# Altium project sdc_prech_proj.PrjPCB (part 2 of 2)

## Sheet BSPD.SchDoc
size A4
Used 2 times, as channels B1, B2. Parts and nets are listed once, with the designators drawn on the sheet.
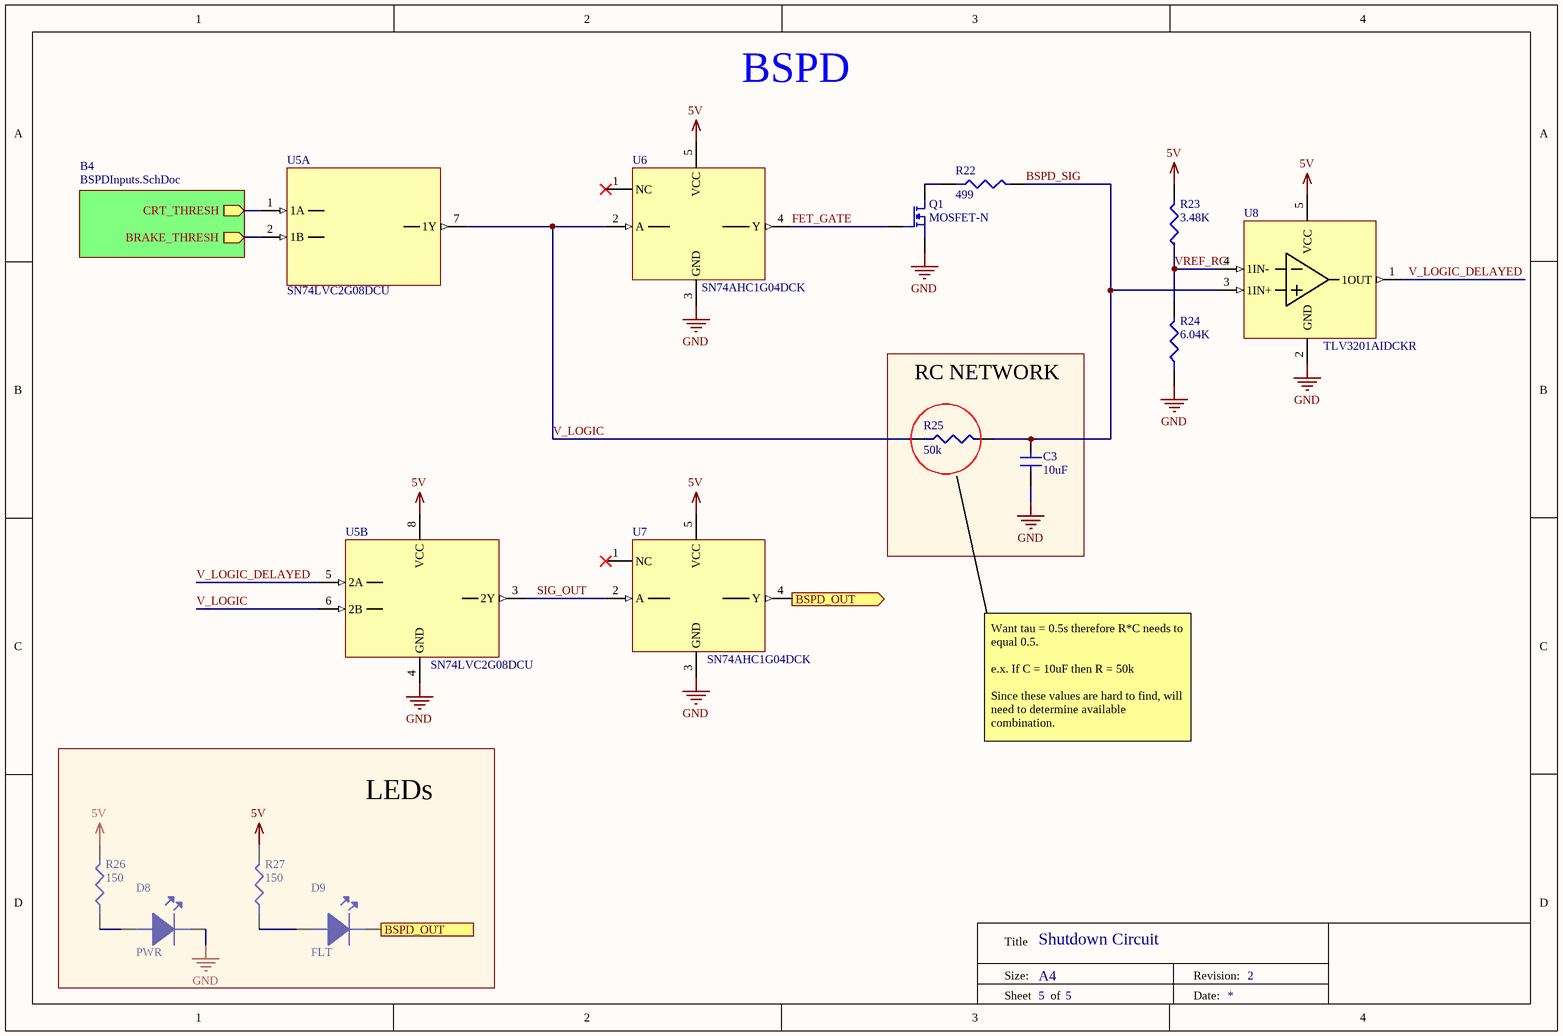
[diagram p3: BSPD.SchDoc]

### Parts
C3  10uF  [C0805]
D8  PWR  [LED_0603]
D9  FLT  [LED_0603]
Q1  MOSFET-N  [MOSFET]
R22  499  [R0805]
R23  3.48K  [R0805]
R24  6.04K  [R0805]
R25  50k  [RESC2013X12N]
R26  150  [RESC2012X07N]
R27  150  [RESC2012X07N]
U5  SN74LVC2G08DCU  [SN74LVC2G08DCUR]  (parts A,B of 2)
U6  SN74AHC1G04DCK  [SN74AHC1G04DCK]
U7  SN74AHC1G04DCK  [SN74AHC1G04DCK]
U8  TLV3201AIDCKR  [TLV3201AIDCK]

### Blocks framed on the sheet
RC NETWORK: C3 R25
LEDs: D8 D9 R26 R27

### Sub-sheets
B4 = BSPDInputs.SchDoc: BRAKE_THRESH (out), CRT_THRESH (out)

### Ports
BSPD_OUT (out)

### Nets
5V: R23.2 R26.2 R27.2 U5.8(VCC) U6.5(VCC) U7.5(VCC) U8.5(VCC)
GND: C3.1 D8.2 Q1.2 R24.1 U5.4(GND) U6.3(GND) U7.3(GND) U8.2(GND)
BSPD_OUT: D9.2 U7.4(Y) ; port BSPD_OUT
BSPD_SIG: C3.2 R22.2 R25.2 U8.3(1IN+)
FET_GATE: Q1.1 U6.4(Y)
SIG_OUT: U5.3(2Y) U7.2(A)
V_LOGIC: R25.1 U5.6(2B) U5.7(1Y) U6.2(A)
V_LOGIC_DELAYED: U5.5(2A) U8.1(1OUT)
VREF_RC: R23.1 R24.2 U8.4(1IN-)
NetD8_1: D8.1 R26.1
NetD9_1: D9.1 R27.1
NetQ1_3: Q1.3 R22.1
NetU5_1: U5.1(1A) ; sheet B4/CRT_THRESH
NetU5_2: U5.2(1B) ; sheet B4/BRAKE_THRESH

Not connected (* = marked no-connect by the designer): U6 1(NC)*; U7 1(NC)*

### Channels
B1: designators end in _B1; ports BSPD_OUT=NetD9_B1_2
B2: designators end in _B2; ports BSPD_OUT=BSPD_TO_VCU

### Notes on the sheet
- BSPD
- Want tau = 0.5s therefore R*C needs to equal 0.5.
  e.x. If C = 10uF then R = 50k
  Since these values are hard to find, will need to determine available combination.
- Shutdown Circuit
- 2
- 5
- Title
- Size:
- A4
- Revision:
- Sheet
- of
- Date:

### Library data of the parts
C3 = CL21A106KPFNNNG: Cap Ceramic 10uF 10V X5R 10% SMD 0805 85C Embossed T/R; Manufacturer: Samsung; Supplier 1: Digi-Key; Manufacturer Part Number: CL21A106KPFNNNG; Stock 1: 0; Pricing 1: 1=0.15, 10=0.104, 100=0.0489, 500=0.03428, 1000=0.02837 (USD); Mount: Surface Mount; Case/Package: 0805; Case Code (Metric): 2012; Case Code (Imperial): 0805; Min Operating Temperature: -55°C; Max Operating Temperature: 85°C; Capacitance: 10uF; Tolerance: 10%; Dielectric: X5R; Voltage: 10V; Voltage Rating: 10V; Packaging: Tape and Reel; Package Quantity: 3000; Termination: Wraparound; Length: 2mm; Height: 1.25mm; Depth: 1.25mm; Width: 0.049inch; Thickness: 0.053inch; Radiation Hardening: No; Lead Free: Lead Free; ComponentLink1URL: http://www1.futureelectronics.com/doc/SAMSUNG/CL21A106KPFNNNG.pdf?src-supplier=Future+Electronics; ComponentLink1Description: http://www1.futureelectronics.com/doc/SAMSUNG/CL21A106KPFNNNG.pdf?src-supplier=Future+Electronics; ComponentLink2URL: https://www.verical.com/server-webapp/html/getDatasheet?partID=640497&src-supplier=Verical; ComponentLink2Description: https://www.verical.com/server-webapp/html/getDatasheet?partID=640497&src-supplier=Verical; Supplier Part Number 1: 1276-6456-1-ND
D8 = LTST-C191KGKT: LED GREEN CLEAR SMD; Manufacturer: Vishay Lite-On; Lens Color: Colorless; Power Rating: 75mW; Luminous Intensity: 35mcd; Viewing Angle: 130°; Lens Style: Diffused,Colorless,Rectangular,Clear; Forward Current: 30mA; Forward Voltage: 2V; Dominant Wavelength: 571nm; Test Current: 20mA; Number of Elements: 1; Wavelength: 574nm; Reverse Voltage: 5V; Supplier 1: Digi-Key; Manufacturer Part Number: LTST-C191KGKT; Stock 1: 1356717; Pricing 1: 1=0.29, 10=0.211, 25=0.1556, 100=0.1111, 250=0.07556, 500=0.06666, 1000=0.05222, 2500=0.05111 (USD); Mount: Surface Mount; Case/Package: 0603; Number of Pins: 2; Color: Green; Case Code (Metric): 1608; Case Code (Imperial): 0603; Min Operating Temperature: -55°C; Max Operating Temperature: 85°C; Packaging: Tape and Reel; Package Quantity: 1; Illumination Color: Green; Lens Transparency: Clear; Power Dissipation: 75mW; Number of LEDs: 1; Length: 1.6mm; Height: 0.55mm; Width: 0.8mm; Depth: 0.8mm; Radiation Hardening: No; Lead Free: Lead Free; ComponentLink1URL: http://www.mouser.com/ds/2/239/LTST-C191KGKT-1141954.pdf?src-supplier=Mouser; ComponentLink1Description: http://www.mouser.com/ds/2/239/LTST-C191KGKT-1141954.pdf?src-supplier=Mouser; ComponentLink2URL: http://optoelectronics.liteon.com/upload/download/DS22-2000-228/LTST-C191KGKT.PDF?src-supplier=Digi-Key; ComponentLink2Description: http://optoelectronics.liteon.com/upload/download/DS22-2000-228/LTST-C191KGKT.PDF?src-supplier=Digi-Key; ComponentLink3URL: https://www.verical.com/server-webapp/html/getDatasheet?partID=103913&src-supplier=Verical; ComponentLink3Description: https://www.verical.com/server-webapp/html/getDatasheet?partID=103913&src-supplier=Verical; ComponentLink4URL: http://uk.rs-online.com/webdocs/0dc0/0900766b80dc02b1.pdf?src-supplier=RSComponents; ComponentLink4Description: http://uk.rs-online.com/webdocs/0dc0/0900766b80dc02b1.pdf?src-supplier=RSComponents; ComponentLink5URL: http://www1.futureelectronics.com/doc/LITE-ON/LTST-C191KGKT.pdf?src-supplier=Future+Electronics; ComponentLink5Description: http://www1.futureelectronics.com/doc/LITE-ON/LTST-C191KGKT.pdf?src-supplier=Future+Electronics; Supplier Part Number 1: 160-1446-1-ND
D9 = LTST-C191KRKT: LED RED CLEAR SMD; Manufacturer: Vishay Lite-On; Lens Color: Colorless; Power Rating: 75mW; Luminous Intensity: 54mcd; Viewing Angle: 130°; Forward Voltage: 2V; Lens Style: Clear,Diffused,Colorless,Rectangular; Forward Current: 30mA; Dominant Wavelength: 631nm; Test Current: 20mA; Number of Elements: 1; Wavelength: 639nm; Reverse Voltage: 5V; Supplier 1: Digi-Key; Manufacturer Part Number: LTST-C191KRKT; Stock 1: 1012880; Pricing 1: 1=0.29, 10=0.211, 25=0.1556, 100=0.1111, 250=0.07556, 500=0.06666, 1000=0.05222, 2500=0.05111 (USD); Mount: Surface Mount; Case/Package: 0603; Number of Pins: 2; Color: Red; Case Code (Metric): 1608; Case Code (Imperial): 0603; Min Operating Temperature: -55°C; Max Operating Temperature: 85°C; Packaging: Tape and Reel; Package Quantity: 1; Illumination Color: Red; Lens Transparency: Clear; Power Dissipation: 75mW; Number of LEDs: 1; Voltage: 2V; Length: 1.6mm; Height: 0.55mm; Width: 0.8mm; Depth: 0.8mm; Radiation Hardening: No; Lead Free: Lead Free; ComponentLink1URL: http://optoelectronics.liteon.com/upload/download/DS22-2000-223/LTST-C191KRKT.PDF?src-supplier=Digi-Key; ComponentLink1Description: http://optoelectronics.liteon.com/upload/download/DS22-2000-223/LTST-C191KRKT.PDF?src-supplier=Digi-Key; ComponentLink2URL: http://www1.futureelectronics.com/doc/LITE-ON/LTST-C191KRKT.pdf?src-supplier=Future+Electronics; ComponentLink2Description: http://www1.futureelectronics.com/doc/LITE-ON/LTST-C191KRKT.pdf?src-supplier=Future+Electronics; ComponentLink3URL: https://www.verical.com/server-webapp/html/getDatasheet?partID=141922&src-supplier=Verical; ComponentLink3Description: https://www.verical.com/server-webapp/html/getDatasheet?partID=141922&src-supplier=Verical; ComponentLink4URL: http://www.mouser.com/ds/2/239/LTST-C191KRKT-1140668.pdf?src-supplier=Mouser; ComponentLink4Description: http://www.mouser.com/ds/2/239/LTST-C191KRKT-1140668.pdf?src-supplier=Mouser; Supplier Part Number 1: 160-1447-1-ND
Q1 = BSS138LT3G: MOSFET N-CH 50V 200MA SOT-23; Manufacturer: ON Semiconductor; Nominal Vgs: 500mV; Input Capacitance: 50pF; Number of Elements: 1; Max Power Dissipation: 225mW; Rds On Max: 3.5R; Turn-Off Delay Time: 20ns; Element Configuration: Single; Gate to Source Voltage (Vgs): 20V; Supplier 1: Digi-Key; Manufacturer Part Number: BSS138LT3G; Stock 1: 195647; Pricing 1: 1=0.45, 10=0.408, 100=0.2284, 500=0.12234, 1000=0.0832 (USD); Case/Package: SOT-23-3; Number of Pins: 3; Min Operating Temperature: -55°C; Max Operating Temperature: 150°C; Package Quantity: 1; Packaging: Tape and Reel; Drain to Source Voltage (Vdss): 50V; Continuous Drain Current (ID): 200mA; Drain to Source Breakdown Voltage: 50V; Power Dissipation: 225mW; Drain to Source Resistance: 3.5R; Threshold Voltage: 500mV; Turn-On Delay Time: 20ns; Voltage Rating (DC): 50V; Current Rating: 200mA; On-State Resistance: 3.5R; Length: 2.9mm; Height: 0.94mm; Width: 1.3mm; Radiation Hardening: No; REACH SVHC: No SVHC; Lead Free: Lead Free; Halogen Free: Halogen Free; Supplier Part Number 1: BSS138LT3GOSCT-ND; ComponentLink1Description: DigiKey; ComponentLink1URL: https://www.digikey.ca/product-detail/en/BSS138LT3G/BSS138LT3GOSCT-ND/2120566/?itemSeq=274498102
R22 = ERA-6AEB4990V: RES SMD 499 OHM 0.1% 1/8W 0805; Manufacturer: Panasonic; Resistance: 499R; Power Rating: 125mW; Voltage Rating: 200V; Temperature Coefficient: 25ppm/°C; Voltage Rating (DC): 100V; Supplier 1: Digi-Key; Manufacturer Part Number: ERA-6AEB4990V; Stock 1: 110604; Pricing 1: 1=0.36, 10=0.302, 100=0.1182, 1000=0.04948, 2500=0.04536 (USD); Mount: Surface Mount; Case/Package: 0805; Number of Pins: 2; Case Code (Imperial): 0805; Case Code (Metric): 2012; Contact Plating: Tin; Min Operating Temperature: -55°C; Max Operating Temperature: 155°C; Tolerance: 0.1%; Packaging: Tape and Reel; Package Quantity: 5000; Termination: SMD/SMT; Composition: Metal Film,Thin Film; Number of Terminations: 2; Military Standard: Not; Max Power Dissipation: 125mW; Working Voltage: 100V; Length: 2mm; Height: 0.5mm; Width: 1.25mm; Depth: 1.25mm; Radiation Hardening: No; Lead Free: Lead Free; REACH SVHC: No SVHC; ComponentLink1URL: http://uk.rs-online.com/webdocs/0eb1/0900766b80eb1d8c.pdf?src-supplier=RSComponents; ComponentLink1Description: http://uk.rs-online.com/webdocs/0eb1/0900766b80eb1d8c.pdf?src-supplier=RSComponents; ComponentLink2URL: http://www.farnell.com/datasheets/485442.pdf?src-supplier=Farnell; ComponentLink2Description: http://www.farnell.com/datasheets/485442.pdf?src-supplier=Farnell; ComponentLink3URL: http://www.farnell.com/datasheets/2052875.pdf?src-supplier=Farnell; ComponentLink3Description: http://www.farnell.com/datasheets/2052875.pdf?src-supplier=Farnell; ComponentLink4URL: http://industrial.panasonic.com/www-data/pdf/AOA0000/AOA0000CE26.pdf?src-supplier=Avnet+Europe; ComponentLink4Description: http://industrial.panasonic.com/www-data/pdf/AOA0000/AOA0000CE26.pdf?src-supplier=Avnet+Europe; ComponentLink5URL: http://www.farnell.com/datasheets/485442.pdf?src-supplier=Element14; ComponentLink5Description: http://www.farnell.com/datasheets/485442.pdf?src-supplier=Element14; ComponentLink6URL: http://industrial.panasonic.com/www-data/pdf/AOA0000/AOA0000CE26.pdf?src-supplier=Avnet; ComponentLink6Description: http://industrial.panasonic.com/www-data/pdf/AOA0000/AOA0000CE26.pdf?src-supplier=Avnet; ComponentLink7URL: https://produktinfo.conrad.com/datenblaetter/450000-474999/459335-da-01-en-WIDERSTAND_0805_ERA.pdf?src-supplier=Conrad; ComponentLink7Description: https://produktinfo.conrad.com/datenblaetter/450000-474999/459335-da-01-en-WIDERSTAND_0805_ERA.pdf?src-supplier=Conrad; Supplier Part Number 1: P499DACT-ND
R23 = ERA-6AEB3481V: RES SMD 3.48K OHM 0.1% 1/8W 0805; Manufacturer: Panasonic; Resistance: 3.48kR; Temperature Coefficient: 25ppm/°C; Power Rating: 125mW; Voltage Rating: 100V; Supplier 1: Digi-Key; Manufacturer Part Number: ERA-6AEB3481V; Stock 1: 4330; Pricing 1: 1=0.36000, 10=0.30200, 100=0.11820, 1000=0.04948, 2500=0.04536 (USD); RoHS: Yes; Mount: Surface Mount; Case/Package: 0805; Number of Pins: 2; Contact Plating: Tin; Case Code (Imperial): 0805; Case Code (Metric): 2012; Min Operating Temperature: -55°C; Max Operating Temperature: 155°C; Tolerance: 0.1%; Composition: Metal Film,Thin Film; Packaging: Tape and Reel; Package Quantity: 1; Number of Terminations: 2; Termination: Solder; Max Power Dissipation: 125mW; Voltage Rating (DC): 100V; Features: Automotive AEC-Q200; Length: 2mm; Height: 0.5mm; Width: 1.25mm; Depth: 1.25mm; Radiation Hardening: No; Lead Free: Lead Free; ComponentLink1URL: https://datasheet.ciiva.com/11810/0900766b80eb1d8c-11810465.pdf?src-supplier=RSComponents; ComponentLink1Description: https://datasheet.ciiva.com/11810/0900766b80eb1d8c-11810465.pdf?src-supplier=RSComponents; ComponentLink2URL: https://datasheet.ciiva.com/41450/001181278-da-01-en-widerstand-era-0805-3k48-0-1-5000st-41450436.pdf?src-supplier=Conrad; ComponentLink2Description: https://datasheet.ciiva.com/41450/001181278-da-01-en-widerstand-era-0805-3k48-0-1-5000st-41450436.pdf?src-supplier=Conrad; ComponentLink3URL: https://datasheet.ciiva.com/9196/aoa0000ce26-9196342.pdf?src-supplier=Avnet; ComponentLink3Description: https://datasheet.ciiva.com/9196/aoa0000ce26-9196342.pdf?src-supplier=Avnet; ComponentLink4URL: https://datasheet.ciiva.com/24026/aoa0000ce26-32660-24026342.pdf?src-supplier=Mouser; ComponentLink4Description: https://datasheet.ciiva.com/24026/aoa0000ce26-32660-24026342.pdf?src-supplier=Mouser; ComponentLink5URL: https://datasheet.ciiva.com/5974/485442-5974247.pdf?src-supplier=Farnell; ComponentLink5Description: https://datasheet.ciiva.com/5974/485442-5974247.pdf?src-supplier=Farnell; ComponentLink6URL: https://datasheet.ciiva.com/5974/485442-5974251.pdf?src-supplier=Farnell; ComponentLink6Description: https://datasheet.ciiva.com/5974/485442-5974251.pdf?src-supplier=Farnell; ComponentLink7URL: https://datasheet.ciiva.com/5974/485442-5974239.pdf?src-supplier=Farnell; ComponentLink7Description: https://datasheet.ciiva.com/5974/485442-5974239.pdf?src-supplier=Farnell; Supplier Part Number 1: P3.48KDACT-ND
R24 = ERA6AEB6041V: RES SMD 6.04K OHM 0.1% 1/8W 0805; Manufacturer: Panasonic; Resistance: 6.04kR; Temperature Coefficient: 25ppm/°C; Power Rating: 125mW; Voltage Rating: 100V; Supplier 1: Digi-Key; Manufacturer Part Number: ERA6AEB6041V; Stock 1: 15898; Pricing 1: 1=0.36, 10=0.302, 100=0.1182, 1000=0.04948, 2500=0.04536 (USD); Mount: Surface Mount; Case/Package: 0805; Number of Pins: 2; Weight: 0.000194oz; Case Code (Imperial): 0805; Case Code (Metric): 2012; Contact Plating: Tin; Min Operating Temperature: -55°C; Max Operating Temperature: 155°C; Packaging: Tape and Reel; Tolerance: 0.1%; Composition: Metal Film,Thin Film; Termination: SMD/SMT; Number of Terminations: 2; Max Power Dissipation: 125mW; Features: Automotive AEC-Q200; Package Quantity: 1; Voltage Rating (DC): 100V; Length: 2mm; Height: 0.5mm; Width: 1.25mm; Depth: 1.25mm; Radiation Hardening: No; Lead Free: Lead Free; ComponentLink1URL: http://www.mouser.com/ds/2/315/AOA0000C237-1100991.pdf?src-supplier=Mouser; ComponentLink1Description: http://www.mouser.com/ds/2/315/AOA0000C237-1100991.pdf?src-supplier=Mouser; ComponentLink2URL: http://www.farnell.com/datasheets/485442.pdf?src-supplier=Element14; ComponentLink2Description: http://www.farnell.com/datasheets/485442.pdf?src-supplier=Element14; ComponentLink3URL: http://industrial.panasonic.com/www-data/pdf/AOA0000/AOA0000CE26.pdf?src-supplier=Avnet; ComponentLink3Description: http://industrial.panasonic.com/www-data/pdf/AOA0000/AOA0000CE26.pdf?src-supplier=Avnet; ComponentLink4URL: http://www.farnell.com/datasheets/485442.pdf?src-supplier=Farnell; ComponentLink4Description: http://www.farnell.com/datasheets/485442.pdf?src-supplier=Farnell; ComponentLink5URL: http://uk.rs-online.com/webdocs/0eb1/0900766b80eb1d8c.pdf?src-supplier=RSComponents; ComponentLink5Description: http://uk.rs-online.com/webdocs/0eb1/0900766b80eb1d8c.pdf?src-supplier=RSComponents; ComponentLink6URL: http://www.produktinfo.conrad.com/datenblaetter/1100000-1199999/001181293-da-01-en-WIDERSTAND_ERA_0805_6K04_0_1__5000ST.pdf?src-supplier=Conrad; ComponentLink6Description: http://www.produktinfo.conrad.com/datenblaetter/1100000-1199999/001181293-da-01-en-WIDERSTAND_ERA_0805_6K04_0_1__5000ST.pdf?src-supplier=Conrad; Supplier Part Number 1: P6.04KDACT-ND
R25 = PTN0805E5002BST1: RES 50K OHM 0.1% 1/5W 0805; Manufacturer: Vishay; Supplier 1: Digi-Key; Manufacturer Part Number: PTN0805E5002BST1; Stock 1: 3755; Pricing 1: 1=0.78, 10=0.647, 100=0.4343 (USD); Supplier Part Number 1: 764-1535-6-ND; ComponentLink1Description: DigiKey; ComponentLink1URL: https://www.digikey.ca/product-detail/en/PTN0805E5002BST1/764-1535-1-ND/7103319/?itemSeq=274495083
R26 R27 = ERJ6ENF1500V: RES SMD 150 OHM 1% 1/8W 0805; Manufacturer: Panasonic; Voltage Rating: 150V; Resistance: 150R; Power Rating: 125mW; Temperature Coefficient: 100ppm/°C; Supplier 1: Digi-Key; Manufacturer Part Number: ERJ6ENF1500V; Stock 1: 125951; Pricing 1: 1=0.1, 10=0.081, 100=0.0311, 1000=0.01367, 2500=0.01181 (USD); Mount: Surface Mount; Case/Package: 0805; Number of Pins: 2; Case Code (Metric): 2012; Case Code (Imperial): 0805; Contact Plating: Tin; Min Operating Temperature: -55°C; Max Operating Temperature: 155°C; Packaging: Tape and Reel; Tolerance: 1%; Package Quantity: 1; Composition: Thick Film; Number of Terminations: 2; Military Standard: Not; Termination: SMD/SMT; Max Power Dissipation: 125mW; Voltage Rating (DC): 150V; Features: Automotive AEC-Q200; Working Voltage: 150V; Length: 2mm; Height: 0.6mm; Width: 0.049inch; Depth: 1.25mm; Radiation Hardening: No; REACH SVHC: No SVHC; Lead Free: Lead Free; ComponentLink1URL: http://www.farnell.com/datasheets/426256.pdf?src-supplier=Element14; ComponentLink1Description: http://www.farnell.com/datasheets/426256.pdf?src-supplier=Element14; ComponentLink2URL: https://www.alliedelec.com/m/d/623f45ff1957d936ff56d46fd1c28cac.pdf?src-supplier=Allied+Electronics; ComponentLink2Description: https://www.alliedelec.com/m/d/623f45ff1957d936ff56d46fd1c28cac.pdf?src-supplier=Allied+Electronics; ComponentLink3URL: http://www.farnell.com/datasheets/1678782.pdf?src-supplier=Element14; ComponentLink3Description: http://www.farnell.com/datasheets/1678782.pdf?src-supplier=Element14; ComponentLink4URL: http://industrial.panasonic.com/www-data/pdf/AOA0000/AOA0000CE2.pdf?src-supplier=Avnet; ComponentLink4Description: http://industrial.panasonic.com/www-data/pdf/AOA0000/AOA0000CE2.pdf?src-supplier=Avnet; ComponentLink5URL: http://www.mouser.com/ds/2/315/AOA0000C283-1093288.pdf?src-supplier=Mouser; ComponentLink5Description: http://www.mouser.com/ds/2/315/AOA0000C283-1093288.pdf?src-supplier=Mouser; ComponentLink6URL: http://www.farnell.com/datasheets/426256.pdf?src-supplier=Farnell; ComponentLink6Description: http://www.farnell.com/datasheets/426256.pdf?src-supplier=Farnell; Supplier Part Number 1: P150CCT-ND
U5 = SN74LVC2G08DCUR: Dual 2-Input Positive-AND Gate; Supplier 1: Digi-Key; Supplier Part Number 1: 296-26615-1-ND
U6 U7 = SN74AHC1G04DCK: The SN74AHC1G04 contains one inverter gate. The / device performs the Boolean function Y = A bar.; Manufacturer: Texas Instruments; Manufacturer Part Number: SN74AHC1G04DCKR; Output Current: 8mA; Number of Inputs: 1; Min Supply Voltage: 2V; Max Supply Voltage: 5.5V; Logic Function: Buffer,Inverter,Inverting; Propagation Delay: 12ns; Quiescent Current: 1uA; High Level Output Current: -8mA; Turn-On Delay Time: 10.6ns; Schmitt Trigger Input: No; Supplier 1: Digi-Key; ComponentLink1Description: Digi-Key; ComponentLink1URL: https://www.digikey.com/product-detail/en/texas-instruments/SN74AHC1G04DCKR/296-1090-1-ND/276358; Supplier Part Number 1: 296-1090-1-ND; Stock 1: 120362; Pricing 1: 1=0.43, 10=0.32, 100=0.1996, 500=0.13658, 1000=0.10506 (USD); Mount: Surface Mount; Case/Package: SC; Number of Pins: 5; Weight: 8.8E-05oz; Contact Plating: Gold; Min Operating Temperature: -40°C; Max Operating Temperature: 125°C; Max Output Current: 8mA; Number of Elements: 1; Packaging: Tape and Reel; Package Quantity: 1; Number of Circuits: 1; Low Level Output Current: 8mA; Termination: SMD/SMT; Number of Gates: 1; Number of Bits: 1; Length: 2mm; Height: 0.9mm; Width: 1.25mm; Radiation Hardening: No; REACH SVHC: No SVHC; Lead Free: Lead Free; ComponentLink2URL: http://www.farnell.com/datasheets/1759812.pdf?src-supplier=Element14; ComponentLink2Description: http://www.farnell.com/datasheets/1759812.pdf?src-supplier=Element14; ComponentLink3URL: http://www.jameco.com/Jameco/Products/ProdDS/912915.pdf?src-supplier=Jameco; ComponentLink3Description: http://www.jameco.com/Jameco/Products/ProdDS/912915.pdf?src-supplier=Jameco; ComponentLink4URL: http://www.ti.com/lit/ds/symlink/sn74ahc1g04.pdf?src-supplier=Digi-Key; ComponentLink4Description: http://www.ti.com/lit/ds/symlink/sn74ahc1g04.pdf?src-supplier=Digi-Key; ComponentLink5URL: https://www.verical.com/server-webapp/html/getDatasheet?partID=53378&src-supplier=Verical; ComponentLink5Description: https://www.verical.com/server-webapp/html/getDatasheet?partID=53378&src-supplier=Verical; ComponentLink6URL: http://www.farnell.com/datasheets/2024272.pdf?src-supplier=Element14; ComponentLink6Description: http://www.farnell.com/datasheets/2024272.pdf?src-supplier=Element14; ComponentLink7URL: http://www.ti.com/general/docs/lit/getliterature.tsp?genericPartNumber=SN74AHC1G04&amp;&amp;fileType=pdf&src-supplier=Avnet+Asia; ComponentLink7Description: http://www.ti.com/general/docs/lit/getliterature.tsp?genericPartNumber=SN74AHC1G04&amp;&amp;fileType=pdf&src-supplier=Avnet+Asia
U8 = TLV3201AIDCKR: Comparator Single R-R I/P 5.5V 5-Pin SC-70 T/R; Manufacturer: Texas Instruments; Common Mode Rejection Ratio: 85dB; Min Supply Voltage: 2.7V; Number of Elements: 1; Propagation Delay: 50ns; Nominal Supply Current: 50uA; Input Offset Voltage (Vos): 5mV; Input Bias Current: 5nA; Quiescent Current: 40uA; Hysteresis: 1.2mV; Response Time: 0.047us; Supplier 1: Digi-Key; Manufacturer Part Number: TLV3201AIDCKR; Stock 1: 34988; Pricing 1: 1=1.36000, 10=1.21500, 100=0.94760, 500=0.78280, 1000=0.61800 (USD); RoHS: Yes; Mount: Surface Mount; Case/Package: SOT-23-5; Number of Pins: 5; Min Operating Temperature: -40°C; Max Operating Temperature: 125°C; Max Supply Voltage: 5.5V; Packaging: Tape and Reel; Package Quantity: 3000; Max Input Current: 5nA; Max Supply Current: 40uA; Number of Channels: 1; Power Supply Rejection Ratio (PSRR): 85dB; Type: General Purpose; Radiation Hardening: No; Lead Free: Lead Free; ComponentLink1URL: https://datasheet.ciiva.com/29635/tlv3201-29635045.pdf?src-supplier=Digi-Key; ComponentLink1Description: https://datasheet.ciiva.com/29635/tlv3201-29635045.pdf?src-supplier=Digi-Key; ComponentLink2URL: https://datasheet.ciiva.com/2966/tlv3202-2966812.pdf?src-supplier=Avnet; ComponentLink2Description: https://datasheet.ciiva.com/2966/tlv3202-2966812.pdf?src-supplier=Avnet; Supplier Part Number 1: 296-36751-1-ND

## Sheet BSPDInputs.SchDoc
size A4
Used 3 times, as channels B1/B4, B3, B2/B4. Parts and nets are listed once, with the designators drawn on the sheet.
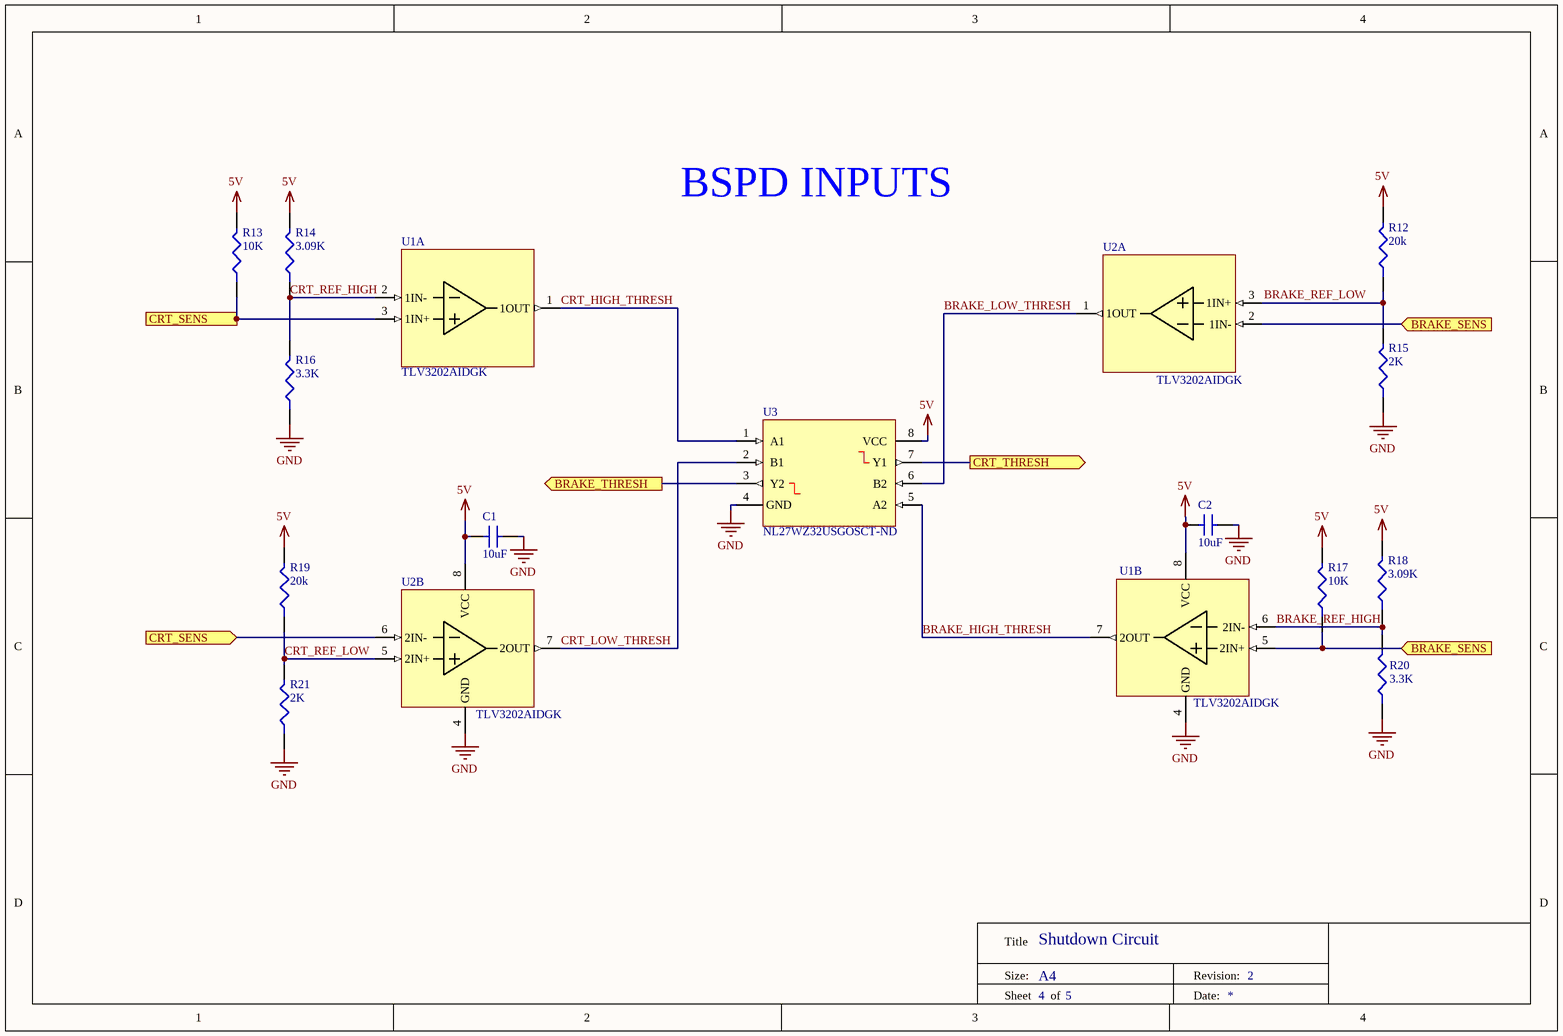
[diagram p4: BSPDInputs.SchDoc]

### Parts
C1  10uF  [C0805]
C2  10uF  [C0805]
R12  20k  [RESC1608X06N]
R13  10K  [R0805]
R14  3.09K  [ERJPB3]
R15  2K  [R0805]
R16  3.3K  [ERJPB3]
R17  10K  [R0805]
R18  3.09K  [ERJPB3]
R19  20k  [RESC1608X06N]
R20  3.3K  [ERJPB3]
R21  2K  [R0805]
U1  TLV3202AIDGK  [TLV3202AIDGK]  (parts A,B of 2)
U2  TLV3202AIDGK  [TLV3202AIDGK]  (parts A,B of 2)
U3  NL27WZ32USGOSCT-ND  [TSSOP50P310X90-8N]

### Ports
BRAKE_SENS (in), BRAKE_THRESH (out), CRT_SENS (in), CRT_THRESH (out)

### Nets
5V: C1.2 C2.2 R12.2 R13.2 R14.2 R17.2 R18.2 R19.2 U1.8(VCC) U2.8(VCC) U3.8(VCC)
GND: C1.1 C2.1 R15.1 R16.1 R20.1 R21.1 U1.4(GND) U2.4(GND) U3.4(GND)
BRAKE_HIGH_THRESH: U1.7(2OUT) U3.5(A2)
BRAKE_LOW_THRESH: U2.1(1OUT) U3.6(B2)
BRAKE_REF_HIGH: R18.1 R20.2 U1.6(2IN-)
BRAKE_REF_LOW: R12.1 R15.2 U2.3(1IN+)
BRAKE_SENS: R17.1 U1.5(2IN+) U2.2(1IN-) ; port BRAKE_SENS
BRAKE_THRESH: U3.3(Y2) ; port BRAKE_THRESH
CRT_HIGH_THRESH: U1.1(1OUT) U3.1(A1)
CRT_LOW_THRESH: U2.7(2OUT) U3.2(B1)
CRT_REF_HIGH: R14.1 R16.2 U1.2(1IN-)
CRT_REF_LOW: R19.1 R21.2 U2.5(2IN+)
CRT_SENS: R13.1 U1.3(1IN+) U2.6(2IN-) ; port CRT_SENS
CRT_THRESH: U3.7(Y1) ; port CRT_THRESH

### Channels
B1/B4: designators end in _B1_B4; ports BRAKE_SENS=NetR17_B1_B4_1 BRAKE_THRESH=NetU3_B1_B4_3 CRT_SENS=NetR13_B1_B4_1 CRT_THRESH=NetU3_B1_B4_7
B3: designators end in _B3; ports BRAKE_SENS=NetM3_3 BRAKE_THRESH=NetU3_B3_3 CRT_SENS=NetM3_2 CRT_THRESH=NetU3_B3_7
B2/B4: designators end in _B2_B4; ports BRAKE_SENS=NetR17_B2_B4_1 BRAKE_THRESH=NetU3_B2_B4_3 CRT_SENS=NetR13_B2_B4_1 CRT_THRESH=NetU3_B2_B4_7

### Notes on the sheet
- BSPD INPUTS
- Shutdown Circuit
- 2
- 4
- 5
- Title
- Size:
- A4
- Revision:
- Sheet
- of
- Date:

### Library data of the parts
C1 C2 = CL21A106KPFNNNG: as C3 on sheet BSPD; Supplier 1: Digi-Key; Manufacturer Part Number: CL21A106KPFNNNG; Stock 1: 0; Pricing 1: 1=0.15, 10=0.104, 100=0.0489, 500=0.03428, 1000=0.02837 (USD); Mount: Surface Mount; Case/Package: 0805; Case Code (Metric): 2012; Case Code (Imperial): 0805; Min Operating Temperature: -55°C; Max Operating Temperature: 85°C; Capacitance: 10uF; Tolerance: 10%; Dielectric: X5R; Voltage: 10V; Voltage Rating: 10V; Packaging: Tape and Reel; Package Quantity: 3000; Termination: Wraparound; Length: 2mm; Height: 1.25mm; Depth: 1.25mm; Width: 0.049inch; Thickness: 0.053inch; Radiation Hardening: No; Lead Free: Lead Free; ComponentLink1URL: http://www1.futureelectronics.com/doc/SAMSUNG/CL21A106KPFNNNG.pdf?src-supplier=Future+Electronics; ComponentLink1Description: http://www1.futureelectronics.com/doc/SAMSUNG/CL21A106KPFNNNG.pdf?src-supplier=Future+Electronics; ComponentLink2URL: https://www.verical.com/server-webapp/html/getDatasheet?partID=640497&src-supplier=Verical; ComponentLink2Description: https://www.verical.com/server-webapp/html/getDatasheet?partID=640497&src-supplier=Verical; Supplier Part Number 1: 1276-6456-1-ND
R12 R19 = RC0603FR-0722KL: YAGEO - RC0603FR-0722KL - SMD Chip Resistor, 0603 [1608 Metric], 22 kohm, RC Series, 75 V, Thick Film, 100 mW; Temperature Coefficient: 100ppm/°C; Tolerance: 1%; Power Rating: 100mW; Resistance: 22kR; Voltage Rating (DC): 50V; Supplier 1: Digi-Key; Manufacturer: Yageo; Manufacturer Part Number: RC0603FR-0722KL; Stock 1: 4730667; Pricing 1: 1=0.10000, 10=0.02300, 100=0.00940, 1000=0.00421, 2500=0.00366 (USD); RoHS: Yes; Case/Package: 0603; Number of Pins: 2; Case Code (Imperial): 0603; Case Code (Metric): 1608; Min Operating Temperature: -55°C; Max Operating Temperature: 155°C; Packaging: Tape and Reel; Features: Moisture Resistant; Termination: SMD/SMT; Composition: Thick Film; Number of Terminations: 2; Max Power Dissipation: 100mW; Voltage Rating: 50V; Package Quantity: 1; Military Standard: Not; Length: 1.6mm; Height: 0.022inch; Depth: 0.8mm; Width: 0.031inch; Lead Free: Lead Free; REACH SVHC: No SVHC; ComponentLink1URL: https://datasheet.ciiva.com/2454/pyu-r-int-thick-7-2454424.pdf?src-supplier=Digi-Key; ComponentLink1Description: https://datasheet.ciiva.com/2454/pyu-r-int-thick-7-2454424.pdf?src-supplier=Digi-Key; ComponentLink2URL: https://datasheet.ciiva.com/2454/pyu-r-int-thick-7-2454425.pdf?src-supplier=Digi-Key; ComponentLink2Description: https://datasheet.ciiva.com/2454/pyu-r-int-thick-7-2454425.pdf?src-supplier=Digi-Key; ComponentLink3URL: https://datasheet.ciiva.com/15189/getdatasheetpartid-413247-15189661.pdf?src-supplier=Verical; ComponentLink3Description: https://datasheet.ciiva.com/15189/getdatasheetpartid-413247-15189661.pdf?src-supplier=Verical; ComponentLink4URL: https://datasheet.ciiva.com/7746/1686128-7746302.pdf?src-supplier=Element14; ComponentLink4Description: https://datasheet.ciiva.com/7746/1686128-7746302.pdf?src-supplier=Element14; ComponentLink5URL: https://datasheet.ciiva.com/46412/443971-46412846.pdf?src-supplier=Element14; ComponentLink5Description: https://datasheet.ciiva.com/46412/443971-46412846.pdf?src-supplier=Element14; ComponentLink6URL: https://datasheet.ciiva.com/7746/443971-7746303.pdf?src-supplier=Element14; ComponentLink6Description: https://datasheet.ciiva.com/7746/443971-7746303.pdf?src-supplier=Element14; ComponentLink7URL: https://datasheet.ciiva.com/2454/pyu-r-int-thick-7-2454423.pdf?src-supplier=Digi-Key; ComponentLink7Description: https://datasheet.ciiva.com/2454/pyu-r-int-thick-7-2454423.pdf?src-supplier=Digi-Key; Supplier Part Number 1: 311-22.0KHRCT-ND
R13 R17 = ERA6AEB103V: RES SMD 10K OHM 0.1% 1/8W 0805; Manufacturer: Panasonic; Voltage Rating: 100V; Resistance: 10kR; Power Rating: 125mW; Temperature Coefficient: 25ppm/°C; Supplier 1: Digi-Key; Manufacturer Part Number: ERA6AEB103V; Stock 1: 677238; Pricing 1: 1=0.36, 10=0.302, 100=0.1182, 1000=0.04948, 2500=0.04536 (USD); Mount: Surface Mount; Case/Package: 0805; Number of Pins: 2; Case Code (Metric): 2012; Case Code (Imperial): 0805; Contact Plating: Tin; Min Operating Temperature: -55°C; Max Operating Temperature: 155°C; Packaging: Tape and Reel; Tolerance: 0.1%; Package Quantity: 5000; Composition: Metal Film,Thin Film; Number of Terminations: 2; Termination: SMD/SMT; Military Standard: Not; Max Power Dissipation: 125mW; Working Voltage: 100V; Voltage Rating (DC): 100V; Length: 2mm; Height: 0.5mm; Width: 1.25mm; Depth: 1.25mm; Radiation Hardening: No; REACH SVHC: No SVHC; Lead Free: Lead Free; ComponentLink1URL: http://uk.rs-online.com/webdocs/0bee/0900766b80beefcc.pdf?src-supplier=RSComponents; ComponentLink1Description: http://uk.rs-online.com/webdocs/0bee/0900766b80beefcc.pdf?src-supplier=RSComponents; ComponentLink2URL: http://www.farnell.com/datasheets/2052875.pdf?src-supplier=Farnell; ComponentLink2Description: http://www.farnell.com/datasheets/2052875.pdf?src-supplier=Farnell; ComponentLink3URL: http://www.farnell.com/datasheets/485442.pdf?src-supplier=Element14; ComponentLink3Description: http://www.farnell.com/datasheets/485442.pdf?src-supplier=Element14; ComponentLink4URL: http://www.mouser.com/ds/2/315/AOA0000CE26-197354.pdf?src-supplier=Mouser; ComponentLink4Description: http://www.mouser.com/ds/2/315/AOA0000CE26-197354.pdf?src-supplier=Mouser; ComponentLink5URL: https://www.distrelec.biz/Web/Downloads/_t/ds/ERA_eng_tds.pdf?mime=application%2Fpdf&src-supplier=Distrelec; ComponentLink5Description: https://www.distrelec.biz/Web/Downloads/_t/ds/ERA_eng_tds.pdf?mime=application%2Fpdf&src-supplier=Distrelec; ComponentLink6URL: http://industrial.panasonic.com/www-data/pdf/AOA0000/AOA0000CE26.pdf?src-supplier=Avnet; ComponentLink6Description: http://industrial.panasonic.com/www-data/pdf/AOA0000/AOA0000CE26.pdf?src-supplier=Avnet; ComponentLink7URL: https://industrial.panasonic.com/cdbs/www-data/pdf/RDM0000/AOA0000C307.pdf?src-supplier=Future+Electronics; ComponentLink7Description: https://industrial.panasonic.com/cdbs/www-data/pdf/RDM0000/AOA0000C307.pdf?src-supplier=Future+Electronics; ComponentLink8URL: http://www.alliedelec.com/m/d/b6b0537e86f421aa7f5975bb1d8f429a.pdf?src-supplier=Allied+Electronics; ComponentLink8Description: http://www.alliedelec.com/m/d/b6b0537e86f421aa7f5975bb1d8f429a.pdf?src-supplier=Allied+Electronics; ComponentLink9URL: http://www.farnell.com/datasheets/2059650.pdf?src-supplier=Element14; ComponentLink9Description: http://www.farnell.com/datasheets/2059650.pdf?src-supplier=Element14; ComponentLink10URL: http://www.farnell.com/datasheets/485442.pdf?src-supplier=Farnell; ComponentLink10Description: http://www.farnell.com/datasheets/485442.pdf?src-supplier=Farnell; ComponentLink11URL: http://www.produktinfo.conrad.com/datenblaetter/450000-474999/453339-da-01-en-WIDERSTAND_0805_ERA.pdf?src-supplier=Conrad; ComponentLink11Description: http://www.produktinfo.conrad.com/datenblaetter/450000-474999/453339-da-01-en-WIDERSTAND_0805_ERA.pdf?src-supplier=Conrad; Supplier Part Number 1: P10KDACT-ND
R14 R18 = ERJ-PB3B3091V: RES SMD 3.09K OHM 0.1% 1/5W 0603; Manufacturer: Panasonic; Resistance: 3.09kR; Max Power Dissipation: 200mW; Temperature Coefficient: 50ppm/°C; Supplier 1: Digi-Key; Manufacturer Part Number: ERJ-PB3B3091V; Stock 1: 4580; Pricing 1: 1=0.25000, 10=0.21100, 25=0.15320, 50=0.11100, 100=0.08230, 250=0.06316, 500=0.04976, 1000=0.03445 (USD); RoHS: Yes; Case/Package: 0603; Case Code (Metric): 1608; Case Code (Imperial): 0603; Min Operating Temperature: -55°C; Max Operating Temperature: 155°C; Packaging: Tape and Reel; Composition: Thick Film; Number of Terminations: 2; Tolerance: 0.1%; Features: Automotive AEC-Q200; Length: 0.063inch; Width: 0.032inch; Height - Seated (Max): 0.022inch; ComponentLink1URL: https://industrial.panasonic.com/sa/system/files/data/download/catalog/id_fixed-resistors_e_2.pdf?src-supplier=Digi-Key; ComponentLink1Description: https://industrial.panasonic.com/sa/system/files/data/download/catalog/id_fixed-resistors_e_2.pdf?src-supplier=Digi-Key; Supplier Part Number 1: P20026CT-ND
R15 R21 = ERA6AEB202V: RES SMD 2K OHM 0.1% 1/8W 0805; Manufacturer: Panasonic; Resistance: 2kR; Power Rating: 125mW; Voltage Rating: 100V; Temperature Coefficient: 25ppm/°C; Supplier 1: Digi-Key; Manufacturer Part Number: ERA6AEB202V; Stock 1: 110386; Pricing 1: 1=0.36, 10=0.302, 100=0.1182, 1000=0.04948, 2500=0.04536 (USD); Mount: Surface Mount; Case/Package: 0805; Number of Pins: 2; Case Code (Metric): 2012; Case Code (Imperial): 0805; Contact Plating: Tin; Min Operating Temperature: -55°C; Max Operating Temperature: 155°C; Tolerance: 0.1%; Packaging: Tape and Reel; Package Quantity: 1; Composition: Thin Film; Termination: SMD/SMT; Number of Terminations: 2; Military Standard: Not; Max Power Dissipation: 125mW; Voltage Rating (DC): 100V; Features: Automotive AEC-Q200; Length: 2mm; Height: 0.5mm; Width: 1.25mm; Depth: 1.25mm; Radiation Hardening: No; REACH SVHC: No SVHC; Lead Free: Lead Free; ComponentLink1URL: http://industrial.panasonic.com/www-data/pdf/AOA0000/AOA0000CE26.pdf?src-supplier=Future+Electronics; ComponentLink1Description: http://industrial.panasonic.com/www-data/pdf/AOA0000/AOA0000CE26.pdf?src-supplier=Future+Electronics; ComponentLink2URL: http://industrial.panasonic.com/www-data/pdf/AOA0000/AOA0000CE26.pdf?src-supplier=Avnet+Europe; ComponentLink2Description: http://industrial.panasonic.com/www-data/pdf/AOA0000/AOA0000CE26.pdf?src-supplier=Avnet+Europe; ComponentLink3URL: https://www.alliedelec.com/m/d/b6b0537e86f421aa7f5975bb1d8f429a.pdf?src-supplier=Allied+Electronics; ComponentLink3Description: https://www.alliedelec.com/m/d/b6b0537e86f421aa7f5975bb1d8f429a.pdf?src-supplier=Allied+Electronics; ComponentLink4URL: http://www.farnell.com/datasheets/485442.pdf?src-supplier=Element14; ComponentLink4Description: http://www.farnell.com/datasheets/485442.pdf?src-supplier=Element14; ComponentLink5URL: http://www.farnell.com/datasheets/1776116.pdf?src-supplier=Element14; ComponentLink5Description: http://www.farnell.com/datasheets/1776116.pdf?src-supplier=Element14; ComponentLink6URL: https://www.distrelec.biz/Web/Downloads/_t/ds/ERA_eng_tds.pdf?mime=application%2Fpdf&src-supplier=Distrelec; ComponentLink6Description: https://www.distrelec.biz/Web/Downloads/_t/ds/ERA_eng_tds.pdf?mime=application%2Fpdf&src-supplier=Distrelec; ComponentLink7URL: http://www.farnell.com/datasheets/2052875.pdf?src-supplier=Farnell; ComponentLink7Description: http://www.farnell.com/datasheets/2052875.pdf?src-supplier=Farnell; ComponentLink8URL: http://www.farnell.com/datasheets/2059650.pdf?src-supplier=Farnell; ComponentLink8Description: http://www.farnell.com/datasheets/2059650.pdf?src-supplier=Farnell; ComponentLink9URL: http://industrial.panasonic.com/www-data/pdf/AOA0000/AOA0000CE26.pdf?src-supplier=Avnet; ComponentLink9Description: http://industrial.panasonic.com/www-data/pdf/AOA0000/AOA0000CE26.pdf?src-supplier=Avnet; ComponentLink10URL: https://produktinfo.conrad.com/datenblaetter/450000-474999/453123-da-01-en-WIDERSTAND_0805_ERA.pdf?src-supplier=Conrad; ComponentLink10Description: https://produktinfo.conrad.com/datenblaetter/450000-474999/453123-da-01-en-WIDERSTAND_0805_ERA.pdf?src-supplier=Conrad; Supplier Part Number 1: P2.0KDACT-ND
R16 R20 = ERJ-PB3B3301V: RES SMD 3.3K OHM 0.1% 1/5W 0603; Manufacturer: Panasonic; Resistance: 3.3kR; Max Power Dissipation: 200mW; Temperature Coefficient: 50ppm/°C; Supplier 1: Digi-Key; Manufacturer Part Number: ERJ-PB3B3301V; Stock 1: 3105; Pricing 1: 1=0.25000, 10=0.21100, 25=0.15320, 50=0.11100, 100=0.08230, 250=0.06316, 500=0.04976, 1000=0.03445 (USD); RoHS: Yes; Case/Package: 0603; Case Code (Metric): 1608; Case Code (Imperial): 0603; Min Operating Temperature: -55°C; Max Operating Temperature: 155°C; Packaging: Tape and Reel; Composition: Thick Film; Number of Terminations: 2; Tolerance: 0.1%; Features: Automotive AEC-Q200; Length: 0.063inch; Width: 0.032inch; Height - Seated (Max): 0.022inch; ComponentLink1URL: https://industrial.panasonic.com/cdbs/www-data/pdf/RDM0000/DMM0000COL5.pdf?src-supplier=Digi-Key; ComponentLink1Description: https://industrial.panasonic.com/cdbs/www-data/pdf/RDM0000/DMM0000COL5.pdf?src-supplier=Digi-Key; Supplier Part Number 1: P20029CT-ND
U1 U2 = TLV3202AIDGK: IC COMPAR PWR RRI DL PP 8VSSOP; Manufacturer: Texas Instruments; Min Supply Voltage: 2.7V; Max Supply Voltage: 5.5V; Number of Elements: 2; Nominal Supply Current: 50uA; Max Supply Current: 40uA; Input Bias Current: 50pA; Input Offset Voltage (Vos): 5mV; Response Time: 0.047us; Propagation Delay: 50ns; Common Mode Rejection Ratio: 70dB; Hysteresis: 1.2mV; Power Supply Rejection Ratio (PSRR): 85dB; ComponentLink1Description: digikey.ca; ComponentLink1URL: https://www.digikey.ca/product-detail/en/texas-instruments/TLV3202AIDGK/296-34992-ND/3588984; Supplier 1: Digi-Key; Manufacturer Part Number: TLV3202AIDGK; Stock 1: 14534; Pricing 1: 1=1.77, 80=1.5, 160=1.278, 560=1.05, 1040=0.87 (USD); Mount: Surface Mount; Case/Package: VSSOP; Number of Pins: 8; Min Operating Temperature: -40°C; Max Operating Temperature: 125°C; Packaging: Rail/Tube; Package Quantity: 80; Number of Channels: 2; Max Input Current: 50pA; Quiescent Current: 50uA; Type: General Purpose; Length: 3.1mm; Height: 0.95mm; Width: 3.1mm; Radiation Hardening: No; Lead Free: Lead Free; REACH SVHC: No SVHC; ComponentLink2URL: https://datasheet.ciiva.com/12288/tlv3202-193866-12288098.pdf; ComponentLink2Description: https://datasheet.ciiva.com/12288/tlv3202-193866-12288098.pdf; ComponentLink3URL: https://datasheet.ciiva.com/23702/1645741-23702136.pdf; ComponentLink3Description: https://datasheet.ciiva.com/23702/1645741-23702136.pdf; ComponentLink4URL: https://datasheet.ciiva.com/8066/1645741-8066013.pdf; ComponentLink4Description: https://datasheet.ciiva.com/8066/1645741-8066013.pdf; Supplier Part Number 1: 296-34992-ND; Supplier 2: Digi-Key
U3 = OR GATE: IC GATE OR 2CH 2-INP US8; Manufacturer: ON Semiconductor; Number of Gates: 2; Propagation Delay: 6.2ns; Max Supply Voltage: 5.5V; Min Supply Voltage: 1.65V; Number of Outputs: 1; Operating Supply Voltage: 3.25V; Schmitt Trigger Input: No; Low Level Output Current: 32mA; Quiescent Current: 1uA; High Level Output Current: -32mA; Turn-On Delay Time: 5.2ns; Output Current: 50mA; Supplier 1: Digi-Key; Manufacturer Part Number: NL27WZ32USG; Stock 1: 5684; Pricing 1: 1=0.39000, 10=0.31700, 25=0.29000, 100=0.21570, 250=0.19548, 500=0.16176, 1000=0.12132 (USD); RoHS: Yes; Mount: Surface Mount; Number of Pins: 8; Contact Plating: Tin,Matte; Min Operating Temperature: -40°C; Max Operating Temperature: 85°C; Packaging: Tape and Reel; Package Quantity: 1; Number of Inputs: 2; Logic Function: OR; Number of Circuits: 2; Number of Elements: 2; Length: 2.4mm; Height: 0.8mm; Width: 2.1mm; Radiation Hardening: No; REACH SVHC: No SVHC; Lead Free: Lead Free; Halogen Free: Halogen Free; ComponentLink1URL: https://datasheet.ciiva.com/8277/nl27wz32-d-8277742.pdf?src-supplier=Avnet; ComponentLink1Description: https://datasheet.ciiva.com/8277/nl27wz32-d-8277742.pdf?src-supplier=Avnet; ComponentLink2URL: https://datasheet.ciiva.com/4820/nl27wz32-d-114831-4820790.pdf?src-supplier=Mouser; ComponentLink2Description: https://datasheet.ciiva.com/4820/nl27wz32-d-114831-4820790.pdf?src-supplier=Mouser; ComponentLink3URL: https://datasheet.ciiva.com/15090/getdatasheetpartid-69948-15090488.pdf?src-supplier=Verical; ComponentLink3Description: https://datasheet.ciiva.com/15090/getdatasheetpartid-69948-15090488.pdf?src-supplier=Verical; ComponentLink4URL: https://datasheet.ciiva.com/26864/nl27wz32usg-26864780.pdf?src-supplier=IIIC; ComponentLink4Description: https://datasheet.ciiva.com/26864/nl27wz32usg-26864780.pdf?src-supplier=IIIC; ComponentLink5URL: https://datasheet.ciiva.com/1872/nl27wz32-d-1872823.pdf?src-supplier=Digi-Key; ComponentLink5Description: https://datasheet.ciiva.com/1872/nl27wz32-d-1872823.pdf?src-supplier=Digi-Key; ComponentLink6URL: https://datasheet.ciiva.com/26049/nl27wz32-d-26049116.pdf?src-supplier=Avnet+Europe; ComponentLink6Description: https://datasheet.ciiva.com/26049/nl27wz32-d-26049116.pdf?src-supplier=Avnet+Europe; ComponentLink7URL: https://datasheet.ciiva.com/1872/nl27wz32-d-1872824.pdf?src-supplier=Digi-Key; ComponentLink7Description: https://datasheet.ciiva.com/1872/nl27wz32-d-1872824.pdf?src-supplier=Digi-Key; ComponentLink8URL: https://datasheet.ciiva.com/1872/nl27wz32-d-1872825.pdf?src-supplier=Digi-Key; ComponentLink8Description: https://datasheet.ciiva.com/1872/nl27wz32-d-1872825.pdf?src-supplier=Digi-Key; ComponentLink9URL: https://datasheet.ciiva.com/16471/nl27wz32-d-16471564.pdf?src-supplier=Future+Electronics; ComponentLink9Description: https://datasheet.ciiva.com/16471/nl27wz32-d-16471564.pdf?src-supplier=Future+Electronics; Supplier Part Number 1: NL27WZ32USGOSCT-ND

## Nets that join several sheets
5V: shutdown_circuit (M2.6), L1 (U2_L1.2), Latch_IMD (U4.2), L3 (U2_L3.2), L4 (U2_L4.2), B1 (7 pins), B1/B4 (11 pins), B3 (11 pins), B2 (7 pins), B2/B4 (11 pins)
BMS Fault: shutdown_circuit (M3.5 R4.1), L3 (U1_L3.5)
BSPD_CHARG_IN: shutdown_circuit (M1.2 TP2.1 TP3.1), L1 (K1_L2.4), Latch_IMD (K2.5)
BSPD_CHARG_OUT: shutdown_circuit (M1.1 M2.5 R1.1 TP1.1), L1 (D8_L2.2 K1_L2.5 K1_L2.6), Latch_IMD (D6.2 K2.6), L3 (D8_L3.2 K1_L3.6), L4 (D8_L4.2 K1_L4.6)
GND: shutdown_circuit (8 pins), L1 (D5_L1.2 U1_L2.4), Latch_IMD (D7.2 R10.2 U3.4), L3 (D5_L3.2 U1_L3.4), L4 (D5_L4.2 U1_L4.4), B1 (8 pins), B1/B4 (9 pins), B3 (9 pins), B2 (8 pins), B2/B4 (9 pins)
IMD Fault: shutdown_circuit (M3.4 R3.1), Latch_IMD (R9.1)
RELAY L3/L4: shutdown_circuit (M1.3 TP6.1 TP7.1), L3 (K1_L3.4), L4 (K1_L4.5)
SDC END: shutdown_circuit (M1.4 M2.7 R2.1 TP8.1), L4 (K1_L4.4)
SET/RESET: shutdown_circuit (M3.7 R6.1 R7.1), L1 (U1_L2.2), Latch_IMD (U3.2), L3 (U1_L3.2), L4 (U1_L4.2)
VCU Fault: shutdown_circuit (M3.6 R5.1), L4 (U1_L4.5)
BSPD_TO_VCU: shutdown_circuit (M3.1), B2 (D9_B2.2 U7_B2.4)
NetM3_2: shutdown_circuit (M3.2), B3 (R13_B3.1 U1_B3.3 U2_B3.6)
NetM3_3: shutdown_circuit (M3.3), B3 (R17_B3.1 U1_B3.5 U2_B3.2)
NetU3_B1_B4_3: B1 (U5_B1.2), B1/B4 (U3_B1_B4.3)
NetU3_B1_B4_7: B1 (U5_B1.1), B1/B4 (U3_B1_B4.7)
NetU3_B2_B4_3: B2 (U5_B2.2), B2/B4 (U3_B2_B4.3)
NetU3_B2_B4_7: B2 (U5_B2.1), B2/B4 (U3_B2_B4.7)
RELAY L2/L3: shutdown_circuit (TP4.1 TP5.1), Latch_IMD (K2.4), L3 (K1_L3.5)